# Altium schematic sheet Steering.SchDoc
size OrCAD B
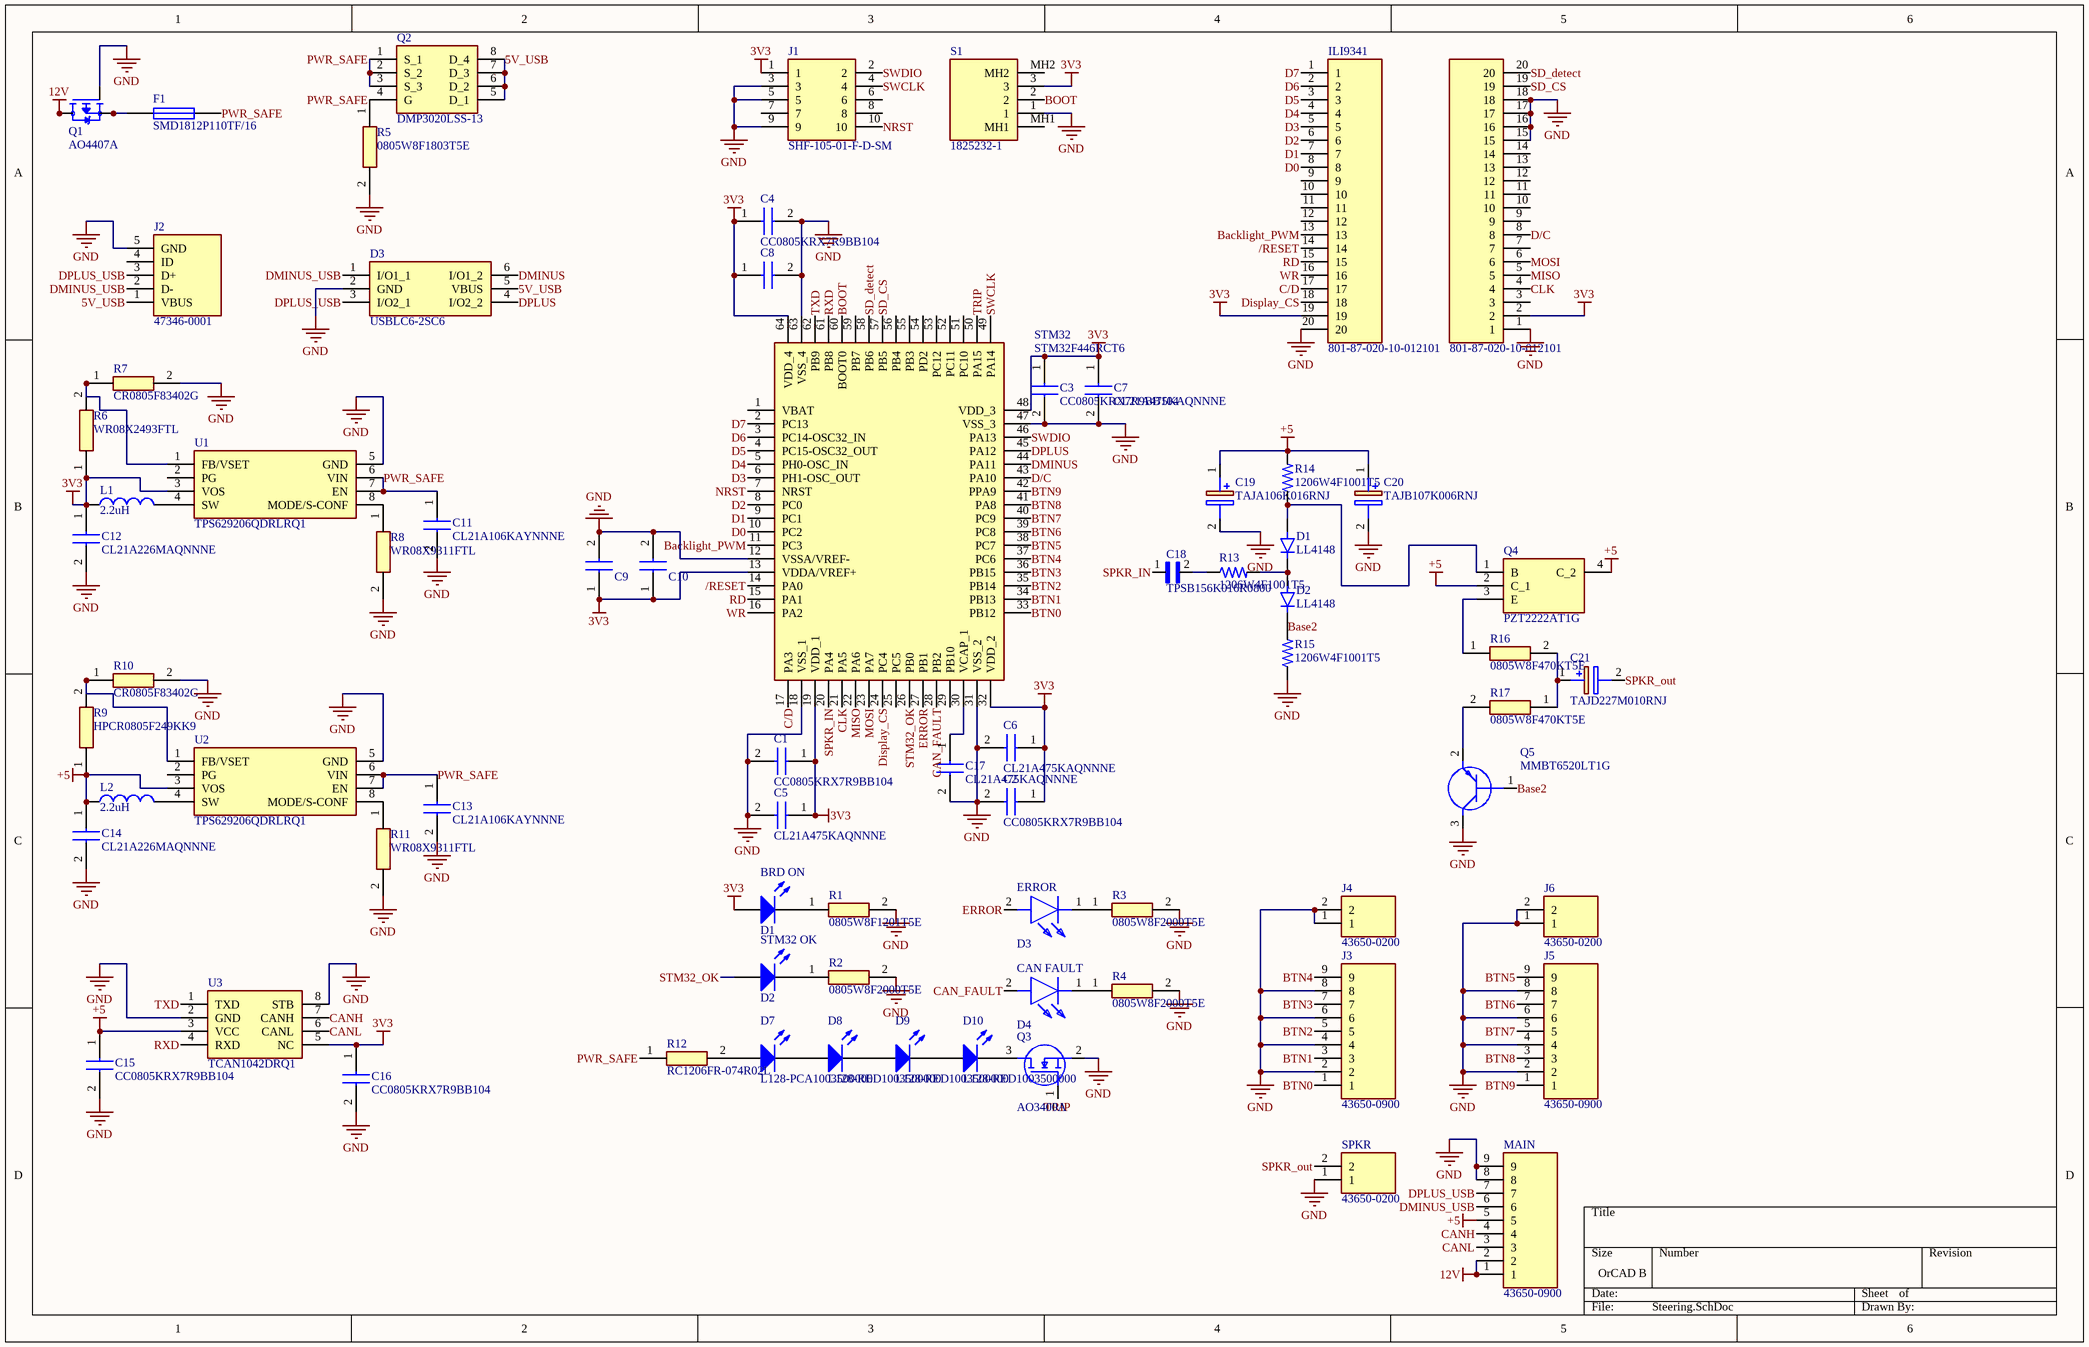
[diagram p0: Steering.SchDoc]

## Parts
?  801-87-020-10-012101  [RHDR20W62P0X254_1X20_5080X254X420P]
BRD_ON  D1  [C0805]
C1  CC0805KRX7R9BB104  [CAPC2012X95N]
C2  CC0805KRX7R9BB104  [CAPC2012X95N]
C3  CC0805KRX7R9BB104  [CAPC2012X95N]
C4  CC0805KRX7R9BB104  [CAPC2012X95N]
C5  CL21A475KAQNNNE  [CAPC2012X140N]
C6  CL21A475KAQNNNE  [CAPC2012X140N]
C7  CL21A475KAQNNNE  [CAPC2012X140N]
C8  CL21A475KAQNNNE  [CAPC2012X140N]  (value not drawn)
C9  CC0805KRX7R9BB104  [CAPC2012X95N]  (value not drawn)
C10  CL21A475KAQNNNE  [CAPC2012X140N]  (value not drawn)
C11  CL21A106KAYNNNE  [CAPC2012X145N]
C12  CL21A226MAQNNNE  [CAPC2012X140N]
C13  CL21A106KAYNNNE  [CAPC2012X145N]
C14  CL21A226MAQNNNE  [CAPC2012X140N]
C15  CC0805KRX7R9BB104  [CAPC2012X95N]
C16  CC0805KRX7R9BB104  [CAPC2012X95N]
C17  CL21A475KAQNNNE  [CAPC2012X140N]
C18  TPSB156K016R0800  [CAPPC3528X210N]
C19  TAJA106K016RNJ  [CAPPM3216X180N]
C20  TAJB107K006RNJ  [CAPPM3528X210N]
C21  TAJD227M010RNJ  [CAPPM7344X310N]
CAN_FAULT  D4  [LEDC1608X80N]
D1  LL4148  [DIO_LL4148]
D2  LL4148  [DIO_LL4148]
D3  USBLC6-2SC6  [SOT95P280X145-6N]
D7  L128-PCA1003500000  [LUXEON 2835]
D8  L128-RED1003500000  [LUXEON 2835]
D9  L128-RED1003500000  [LUXEON 2835]
D10  L128-RED1003500000  [LUXEON 2835]
ERROR  D3  [LEDC1608X80N]
F1  SMD1812P110TF/16  [FUSE_1812L200/12DR]
ILI9341  801-87-020-10-012101  [RHDR20W62P0X254_1X20_5080X254X420P]
J1  SHF-105-01-F-D-SM  [2002112100010C1LF]
J2  47346-0001  [47346-0001]
J3  43650-0900  [436500900]
J4  43650-0200  [43650-02(00,01,02)]
J5  43650-0900  [436500900]
J6  43650-0200  [43650-02(00,01,02)]
L1  value 2.2uH  [LVS505040-2R2M-N]  (hidden comment: LVS505040-2R2M-N)
L2  value 2.2uH  [LVS505040-2R2M-N]  (hidden comment: LVS505040-2R2M-N)
MAIN  43650-0900  [436500900]
Q1  AO4407A  [SOIC127P600X175-8N]
Q2  DMP3020LSS-13  [DMP3020LSS13]
Q3  AO3400A  [SOT95P280X125-3N]
Q4  PZT2222AT1G  [SOT230P700X175-4N]
Q5  MMBT6520LT1G  [SOT96P237X111-3N]
R1  0805W8F1201T5E  [RESC2012X60N]
R2  0805W8F2000T5E  [RESC2012X60N]
R3  0805W8F2000T5E  [RESC2012X60N]
R4  0805W8F2000T5E  [RESC2012X60N]
R5  0805W8F1803T5E  [RESC2012X60N]
R6  WR08X2493FTL  [RESC2012X60N]
R7  CR0805F83402G  [RESC2012X60N]
R8  WR08X9311FTL  [RESC2012X60N]
R9  HPCR0805F249KK9  [RESC2012X60N]
R10  CR0805F83402G  [RESC2012X60N]
R11  WR08X9311FTL  [RESC2012X60N]
R12  RC1206FR-074R02L  [RESC3116X65N]
R13  1206W4F1001T5  [RESC3115X65N]
R14  1206W4F1001T5  [RESC3115X65N]
R15  1206W4F1001T5  [RESC3115X65N]
R16  0805W8F470KT5E  [RESC2012X60N]
R17  0805W8F470KT5E  [RESC2012X60N]
S1  1825232-1  [18252321]
SPKR  43650-0200  [43650-02(00,01,02)]
STM32  STM32F446RCT6  [QFP50P1200X1200X160-64N]
STM32_OK  D2  [C0805]
U1  TPS629206QDRLRQ1  [SOTFL50P160X60-8N]
U2  TPS629206QDRLRQ1  [SOTFL50P160X60-8N]
U3  TCAN1042DRQ1  [SOIC127P600X175-8N]

## Nets
3V3: ?.2 BRD_ON.1(A) C1.1 C2.1 C3.1 C4.1 C5.1 C6.1 C7.1 C8.1 C9.1 C10.1 C12.1 C16.1 ILI9341.19 J1.1 L1.1 R6.1 S1.3 STM32.13(VDDA/VREF+) STM32.19(VDD_1) STM32.32(VDD_2) STM32.48(VDD_3) STM32.64(VDD_4) U1.3(VOS) U3.5(NC)
12V: MAIN.1 MAIN.2 Q1.5(D) Q1.6(D) Q1.7(D) Q1.8(D)
+5: C14.1 C15.1 C19.1(+) C20.1(+) L2.1 MAIN.5 Q4.2(C_1) Q4.4(C_2) R9.1 R14.2 U2.3(VOS) U3.3(VCC)
GND: ?.1 ?.15 ?.16 ?.17 ?.18 C1.2 C2.2 C3.2 C4.2 C5.2 C6.2 C7.2 C8.2 C9.2 C10.2 C11.2 C12.2 C13.2 C14.2 C15.2 C16.2 C17.2 C19.2(-) C20.2(-) D3.2(GND) ILI9341.20 J1.3 J1.5 J1.9 J2.5(GND) J3.2 J3.4 J3.6 J3.8 J4.1 J4.2 J5.2 J5.4 J5.6 J5.8 J6.1 J6.2 MAIN.8 MAIN.9 Q1.4(G) Q3.2(S) Q5.3(C) R1.2 R2.2 R3.2 R4.2 R5.2 R7.2 R8.2 R10.2 R11.2 R15.1 S1.1 SPKR.1 STM32.12(VSSA/VREF-) STM32.18(VSS_1) STM32.31(VSS_2) STM32.47(VSS_3) STM32.63(VSS_4) U1.5(GND) U2.5(GND) U3.2(GND) U3.8(STB)
5V_USB: D3.5(VBUS) J2.1(VBUS) Q2.5(D_1) Q2.6(D_2) Q2.7(D_3) Q2.8(D_4)
/RESET: ILI9341.14 STM32.14(PA0)
Backlight_PWM: ILI9341.13 STM32.11(PC3)
Base2: D2.C Q5.1(B) R15.2
BOOT: S1.2 STM32.60(BOOT0)
BTN0: J3.1 STM32.33(PB12)
BTN1: J3.3 STM32.34(PB13)
BTN2: J3.5 STM32.35(PB14)
BTN3: J3.7 STM32.36(PB15)
BTN4: J3.9 STM32.37(PC6)
BTN5: J5.9 STM32.38(PC7)
BTN6: J5.7 STM32.39(PC8)
BTN7: J5.5 STM32.40(PC9)
BTN8: J5.3 STM32.41(PA8)
BTN9: J5.1 STM32.42(PPA9)
C/D: ILI9341.17 STM32.17(PA3)
CAN_FAULT: CAN_FAULT.2(A) STM32.28(PB2)
CANH: MAIN.4 U3.7(CANH)
CANL: MAIN.3 U3.6(CANL)
CLK: ?.4 STM32.21(PA5)
D0: ILI9341.8 STM32.10(PC2)
D1: ILI9341.7 STM32.9(PC1)
D2: ILI9341.6 STM32.8(PC0)
D3: ILI9341.5 STM32.6(PH1-OSC_OUT)
D4: ILI9341.4 STM32.5(PH0-OSC_IN)
D5: ILI9341.3 STM32.4(PC15-OSC32_OUT)
D6: ILI9341.2 STM32.3(PC14-OSC32_IN)
D7: ILI9341.1 STM32.2(PC13)
D/C: ?.8 STM32.43(PA10)
Display_CS: ILI9341.18 STM32.24(PC4)
DMINUS: D3.6(I/O1_2) STM32.44(PA11)
DMINUS_USB: D3.1(I/O1_1) J2.2(D-) MAIN.6
DPLUS: D3.4(I/O2_2) STM32.45(PA12)
DPLUS_USB: D3.3(I/O2_1) J2.3(D+) MAIN.7
ERROR: ERROR.2(A) STM32.27(PB1)
MISO: ?.5 STM32.22(PA6)
MOSI: ?.6 STM32.23(PA7)
NRST: J1.10 STM32.7(NRST)
PWR_SAFE: C11.1 C13.1 F1.2 Q2.1(S_1) Q2.2(S_2) Q2.3(S_3) Q2.4(G) R5.1 R12.1 U1.6(VIN) U1.7(EN) U2.6(VIN) U2.7(EN)
RD: ILI9341.15 STM32.15(PA1)
RXD: STM32.61(PB8) U3.4(RXD)
SD_CS: ?.19 STM32.57(PB5)
SD_detect: ?.20 STM32.58(PB6)
SPKR_IN: C18.1 STM32.20(PA4)
SPKR_out: C21.2(-) SPKR.2
STM32_OK: STM32.26(PB0) STM32_OK.1(A)
SWCLK: J1.4 STM32.49(PA14)
SWDIO: J1.2 STM32.46(PA13)
TRIP: Q3.1(G) STM32.50(PA15)
TXD: STM32.62(PB9) U3.1(TXD)
WR: ILI9341.16 STM32.16(PA2)
NetBRD_ON_2: BRD_ON.2(K) R1.1
NetC17_1: C17.1 STM32.30(VCAP_1)
NetC18_2: C18.2 R13.1
NetC21_1: C21.1(+) R16.2 R17.1
NetCAN_FAULT_1: CAN_FAULT.1(K) R4.1
NetD1_A: D1.A Q4.1(B) R14.1
NetD1_C: D1.C D2.A R13.2
NetD7_1: D7.1(A) R12.2
NetD7_2: D7.2(K) D8.1(A)
NetD8_2: D8.2(K) D9.1(A)
NetD9_2: D9.2(K) D10.1(A)
NetD10_2: D10.2(K) Q3.3(D)
NetERROR_1: ERROR.1(K) R3.1
NetF1_1: F1.1 Q1.1(S) Q1.2(S) Q1.3(S)
NetL1_2: L1.2 U1.4(SW)
NetL2_2: L2.2 U2.4(SW)
NetQ4_3: Q4.3(E) R16.1
NetQ5_2: Q5.2(E) R17.2
NetR2_1: R2.1 STM32_OK.2(K)
NetR6_2: R6.2 R7.1 U1.1(FB/VSET)
NetR8_1: R8.1 U1.8(MODE/S-CONF)
NetR9_2: R9.2 R10.1 U2.1(FB/VSET)
NetR11_1: R11.1 U2.8(MODE/S-CONF)

Not connected (* = marked no-connect by the designer): ? 3 7 9 10 11 12 13 14; ILI9341 9 10 11 12; J1 6 7 8; J2 4(ID); S1 MH1 MH2; STM32 1(VBAT) 25(PC5) 29(PB10) 51(PC10) 52(PC11) 53(PC12) 54(PD2) 55(PB3) 56(PB4) 59(PB7); U1 2(PG); U2 2(PG)

## Library data of the parts
? ILI9341 = 801-87-020-10-012101: Connector; Manufacturer_Name: Preci-Dip; Datasheet Link: https://www.precidip.com/en/Products/PCB-Connectors/pview/801-PP-NNN-10-012101.html; Height: 4.2mm; Manufacturer_Part_Number: 801-87-020-10-012101; Mouser Part Number: 437-8018702010012101; Mouser Price/Stock: https://www.mouser.com/Search/ProductDetail.aspx?qs=q5BRkYolQ3gOW%2fp3dsbSdw%3d%3d
BRD_ON STM32_OK = LED0: C2297; Published: 8-Jun-2000; LatestRevisionDate: 08-Jul-2005; LatestRevisionNote: Mech Layer 1 removed.; PackageReference: LED-0; Publisher: Altium Limited; PackageDescription: LED; 2 Leads
C1-C4 C9 C15 C16 = CC0805KRX7R9BB104: C49678; Manufacturer_Name: YAGEO; Datasheet Link: https://www.yageo.com/upload/media/product/productsearch/datasheet/mlcc/UPY-GPHC_X7R_6.3V-to-50V_20.pdf; Height: 0.95mm; Manufacturer_Part_Number: CC0805KRX7R9BB104; Mouser Part Number: 603-CC805KRX7R9BB104; Mouser Price/Stock: https://www.mouser.co.uk/ProductDetail/YAGEO/CC0805KRX7R9BB104?qs=vTakOoo5QyLx0lXWgVtRhQ%3D%3D; Arrow Part Number: CC0805KRX7R9BB104; Arrow Price/Stock: https://www.arrow.com/en/products/cc0805krx7r9bb104/yageo?region=europe
C5-C8 C10 C17 = CL21A475KAQNNNE: C1779; Manufacturer_Name: Samsung Electro-Mechanics; Datasheet Link: https://datasheet.datasheetarchive.com/originals/distributors/Datasheets_SAMA/7c2e9fae61a8ce6685f6522ddec12c79.pdf; Height: 1.4mm; Manufacturer_Part_Number: CL21A475KAQNNNE
C11 C13 = CL21A106KAYNNNE: C15850; Manufacturer_Name: Samsung Electro-Mechanics; Datasheet Link: https://datasheet.datasheetarchive.com/originals/distributors/Datasheets_SAMA/6a45835c9b7400e9b49c55c38a8ff4a2.pdf; Height: 1.45mm; Manufacturer_Part_Number: CL21A106KAYNNNE
C12 C14 = CL21A226MAQNNNE: C45783; Manufacturer_Name: Samsung Electro-Mechanics; Datasheet Link: https://datasheet.datasheetarchive.com/originals/distributors/Datasheets-DGA10/2406310.pdf; Height: 1.4mm; Manufacturer_Part_Number: CL21A226MAQNNNE
C18 = TPSB156K016R0800: C308885; Package: None; Price: None; Value: *; MP: TPSB156K016R0800; Availability: Unavailable
C19 = TAJA106K016RNJ: C7171; Manufacturer_Name: AVX; Datasheet Link: http://www.farnell.com/datasheets/1680476.pdf; Height: 1.8mm; Manufacturer_Part_Number: TAJA106K016RNJ; Mouser Part Number: 581-TAJA106K016R; Mouser Price/Stock: https://www.mouser.co.uk/ProductDetail/AVX/TAJA106K016RNJ?qs=OVpPYgiJXXV05Cvf2fCYWQ%3D%3D; Arrow Part Number: TAJA106K016RNJ; Arrow Price/Stock: https://www.arrow.com/en/products/taja106k016rnj/avx
C20 = TAJB107K006RNJ: C16133; Manufacturer_Name: AVX; Datasheet Link: http://datasheets.avx.com/TAJ.pdf; Height: 2.1mm; Manufacturer_Part_Number: TAJB107K006RNJ; Mouser Part Number: 581-TAJB107K006R; Mouser Price/Stock: https://www.mouser.co.uk/ProductDetail/AVX/TAJB107K006RNJ?qs=fdqkYiOtZpcsxthKdBMg8Q%3D%3D; Arrow Part Number: TAJB107K006RNJ; Arrow Price/Stock: https://www.arrow.com/en/products/tajb107k006rnj/avx?region=nac
C21 = TAJD227M010RNJ: C11381; Manufacturer_Name: AVX; Datasheet Link: http://datasheets.avx.com/TAJ.pdf; Height: 3.1mm; Manufacturer_Part_Number: TAJD227M010RNJ; Mouser Part Number: 581-TAJD227M010R; Mouser Price/Stock: https://www.mouser.co.uk/ProductDetail/AVX/TAJD227M010RNJ?qs=vQJa%252BfcOt8NxOIbJEsT5Zg%3D%3D; Arrow Part Number: TAJD227M010RNJ; Arrow Price/Stock: https://www.arrow.com/en/products/tajd227m010rnj/avx
CAN_FAULT ERROR = 150060VS75000: C2286; Manufacturer_Name: Wurth Elektronik; Datasheet Link: https://componentsearchengine.com/Datasheets/2/150060VS75000.pdf; Height: 0.8mm; Manufacturer_Part_Number: 150060VS75000; Mouser Part Number: 710-150060VS75000; Mouser Price/Stock: https://www.mouser.co.uk/ProductDetail/Wurth-Elektronik/150060VS75000?qs=LlUlMxKIyB1Q1Bi5mQ%2FKLw%3D%3D
D1 D2 = LL4148: C9808; MF: Diotec Semiconductor; Value: *; SnapEDA_Link: https://www.snapeda.com/parts/LL4148/Diotec/view-part/?ref=snap; Purchase-URL: https://pricing.snapeda.com/search/part/LL4148/?ref=eda; Availability: In Stock; Price: None; Package: MINIMELF-2 Diotec; Check_prices: https://www.snapeda.com/parts/LL4148/Diotec/view-part/?ref=eda; MP: LL4148
D3 = USBLC6-2SC6: C5180249; Manufacturer_Name: STMicroelectronics; Datasheet Link: https://componentsearchengine.com//USBLC6-2SC6.pdf; Height: 1.45mm; Mouser2 Part Number: 511-USBLC6-2SC6; Mouser2 Price/Stock: https://www.mouser.com/Search/Refine.aspx?Keyword=511-USBLC6-2SC6; Manufacturer_Part_Number: USBLC6-2SC6
D7-D10 = LED0: Published: 8-Jun-2000; LatestRevisionDate: 08-Jul-2005; LatestRevisionNote: Mech Layer 1 removed.; PackageReference: LED-0; Publisher: Altium Limited; PackageDescription: LED; 2 Leads
F1 = Fuse 1: C209723; Published: 8-Jun-2000; LatestRevisionDate: 17-Jul-2002; LatestRevisionNote: Re-released for DXP Platform.; PackageReference: PIN-W2/E2.8; Publisher: Altium Limited; PackageDescription: Thru-Hole; 2 Leads
J1 = 20021121-00010C1LF: Connector; Manufacturer_Name: Amphenol Communication Solutions; Datasheet Link: https://cdn.amphenol-cs.com/media/wysiwyg/files/drawing/20021121.pdf; Height: 5.5mm; Manufacturer_Part_Number: 20021121-00010C1LF; Mouser Part Number: 649-200211210010C1LF; Mouser Price/Stock: https://www.mouser.co.uk/ProductDetail/Amphenol-FCI/20021121-00010C1LF?qs=oJs1R%252BxK6kSzutWTkBqfDw%3D%3D; Arrow Part Number: 20021121-00010C1LF; Arrow Price/Stock: https://www.arrow.com/en/products/20021121-00010c1lf/amphenol-fci
J2 = 47346-0001: C132560; Manufacturer_Name: Molex; Datasheet Link: http://www.molex.com/pdm_docs/sd/473460001_sd.pdf; Manufacturer_Part_Number: 47346-0001
J3 J5 MAIN = 43650-0900: Connector; Manufacturer_Name: Molex; Datasheet Link: https://www.molex.com/pdm_docs/sd/436500900_sd.pdf; Height: 5.57mm; Manufacturer_Part_Number: 43650-0900
J4 J6 SPKR = 43650-0200: Connector; Manufacturer_Name: Molex; Datasheet Link: https://www.molex.com/pdm_docs/sd/436500200_sd.pdf; Height: 5.57mm; Manufacturer_Part_Number: 43650-0200; Mouser Part Number: 538-43650-0200; Mouser Price/Stock: https://www.mouser.co.uk/ProductDetail/Molex/43650-0200?qs=HlEFOAM0q6XGaAJJj3Pssw%3D%3D
L1 L2 = Inductor: C280539; Code_IEC: 1005; Published: 8-Jun-2000; LatestRevisionDate: 29-May-2009; LatestRevisionNote: IPC-7351 Footprint Added.; PackageReference: 0402-A; Publisher: Altium Limited; PackageDescription: Chip Inductor; Code_JEITA: 0402
Q1 = AO4407A: C382328; MF: Alpha &; Value: *; SnapEDA_Link: https://www.snapeda.com/parts/AO4407A/Alpha%20%26%20Omega%20Semiconductor%20Inc./view-part/492696/?ref=snap; MP: AO4407A; Availability: Unavailable; Price: None; Package: SOIC-8 Alpha &amp; Omega Semiconductor
Q2 = DMP3020LSS-13: C382328; Manufacturer_Name: Diodes Inc.; Datasheet Link: http://uk.rs-online.com/web/p/products/8234028; Height: 1.75mm; Manufacturer_Part_Number: DMP3020LSS-13; Mouser Part Number: 621-DMP3020LSS-13; Mouser Price/Stock: https://www.mouser.co.uk/ProductDetail/Diodes-Incorporated/DMP3020LSS-13?qs=ptj1V1atRApSH7nA47yoew%3D%3D
Q3 = AO3400A: C20917; Manufacturer_Name: Alpha & Omega Semiconductors; Datasheet Link: http://aosmd.com/res/data_sheets/AO3400A.pdf; Height: 1.25mm; Manufacturer_Part_Number: AO3400A; Arrow Part Number: AO3400A; Arrow Price/Stock: https://www.arrow.com/en/products/ao3400a/alpha-and-omega-semiconductor?region=europe
Q4 = PZT2222AT1G: C115272; Manufacturer_Name: onsemi; Datasheet Link: http://www.onsemi.com/pub/Collateral/PZT2222AT1-D.PDF; Height: 1.75mm; Manufacturer_Part_Number: PZT2222AT1G; Mouser Part Number: 863-PZT2222AT1G; Mouser Price/Stock: https://www.mouser.co.uk/ProductDetail/onsemi/PZT2222AT1G?qs=xZq1yRCsb1df8552Y4NpWQ%3D%3D; Arrow Part Number: PZT2222AT1G; Arrow Price/Stock: https://www.arrow.com/en/products/pzt2222at1g/on-semiconductor?region=europe
Q5 = MMBT6520LT1G: C94999; Manufacturer_Name: onsemi; Datasheet Link: http://www.onsemi.com/pub/Collateral/MMBT6520LT1-D.PDF; Height: 1.11mm; Manufacturer_Part_Number: MMBT6520LT1G; Mouser Part Number: 863-MMBT6520LT1G; Mouser Price/Stock: https://www.mouser.co.uk/ProductDetail/onsemi/MMBT6520LT1G?qs=HVbQlW5zcXW6B5Cj3%252BF%252BaQ%3D%3D; Arrow Part Number: MMBT6520LT1G; Arrow Price/Stock: https://www.arrow.com/en/products/mmbt6520lt1g/on-semiconductor?region=nac
R1 = RK73H2ATTD1543F: C17379; Manufacturer_Name: KOA Speer; Datasheet Link: http://www.koaspeer.com/catimages/Products/RK73H/RK73H.pdf; Height: 0.6mm; Manufacturer_Part_Number: RK73H2ATTD1543F; Mouser Part Number: 660-RK73H2ATTD1543F; Mouser Price/Stock: https://www.mouser.co.uk/ProductDetail/KOA-Speer/RK73H2ATTD1543F?qs=thJ8CQs%2FE%2FulTjcEA4nvBA%3D%3D
R2-R4 = RK73H2ATTD1543F: C17540; Manufacturer_Name: KOA Speer; Datasheet Link: http://www.koaspeer.com/catimages/Products/RK73H/RK73H.pdf; Height: 0.6mm; Manufacturer_Part_Number: RK73H2ATTD1543F; Mouser Part Number: 660-RK73H2ATTD1543F; Mouser Price/Stock: https://www.mouser.co.uk/ProductDetail/KOA-Speer/RK73H2ATTD1543F?qs=thJ8CQs%2FE%2FulTjcEA4nvBA%3D%3D
R5 = RK73H2ATTD1543F: C17501; Manufacturer_Name: KOA Speer; Datasheet Link: http://www.koaspeer.com/catimages/Products/RK73H/RK73H.pdf; Height: 0.6mm; Manufacturer_Part_Number: RK73H2ATTD1543F; Mouser Part Number: 660-RK73H2ATTD1543F; Mouser Price/Stock: https://www.mouser.co.uk/ProductDetail/KOA-Speer/RK73H2ATTD1543F?qs=thJ8CQs%2FE%2FulTjcEA4nvBA%3D%3D
R6 = RK73H2ATTD1543F: C170853; Manufacturer_Name: KOA Speer; Datasheet Link: http://www.koaspeer.com/catimages/Products/RK73H/RK73H.pdf; Height: 0.6mm; Manufacturer_Part_Number: RK73H2ATTD1543F; Mouser Part Number: 660-RK73H2ATTD1543F; Mouser Price/Stock: https://www.mouser.co.uk/ProductDetail/KOA-Speer/RK73H2ATTD1543F?qs=thJ8CQs%2FE%2FulTjcEA4nvBA%3D%3D
R7 R10 = RK73H2ATTD1543F: C101673; Manufacturer_Name: KOA Speer; Datasheet Link: http://www.koaspeer.com/catimages/Products/RK73H/RK73H.pdf; Height: 0.6mm; Manufacturer_Part_Number: RK73H2ATTD1543F; Mouser Part Number: 660-RK73H2ATTD1543F; Mouser Price/Stock: https://www.mouser.co.uk/ProductDetail/KOA-Speer/RK73H2ATTD1543F?qs=thJ8CQs%2FE%2FulTjcEA4nvBA%3D%3D
R8 R11 = RK73H2ATTD1543F: C334950; Manufacturer_Name: KOA Speer; Datasheet Link: http://www.koaspeer.com/catimages/Products/RK73H/RK73H.pdf; Height: 0.6mm; Manufacturer_Part_Number: RK73H2ATTD1543F; Mouser Part Number: 660-RK73H2ATTD1543F; Mouser Price/Stock: https://www.mouser.co.uk/ProductDetail/KOA-Speer/RK73H2ATTD1543F?qs=thJ8CQs%2FE%2FulTjcEA4nvBA%3D%3D
R9 = RK73H2ATTD1543F: C365271; Manufacturer_Name: KOA Speer; Datasheet Link: http://www.koaspeer.com/catimages/Products/RK73H/RK73H.pdf; Height: 0.6mm; Manufacturer_Part_Number: RK73H2ATTD1543F; Mouser Part Number: 660-RK73H2ATTD1543F; Mouser Price/Stock: https://www.mouser.co.uk/ProductDetail/KOA-Speer/RK73H2ATTD1543F?qs=thJ8CQs%2FE%2FulTjcEA4nvBA%3D%3D
R12 = CRGH1206J47R: Resistor; Manufacturer_Name: TE Connectivity; Datasheet Link: https://datasheet.datasheetarchive.com/originals/distributors/DKDS-21/401697.pdf; Height: 0.65mm; Manufacturer_Part_Number: CRGH1206J47R; Mouser Part Number: 279-CRGH1206J47R; Mouser Price/Stock: https://www.mouser.co.uk/ProductDetail/TE-Connectivity-Holsworthy/CRGH1206J47R?qs=8G8kQhBkhGhjy%252BXe1hT%2FBA%3D%3D
R13-R15 = 6-1879261-8: C4410; Package: None; Price: None; Value: *; MP: 6-1879261-8; Availability: Unavailable
R16 R17 = RK73H2ATTD1543F: C17675; Manufacturer_Name: KOA Speer; Datasheet Link: http://www.koaspeer.com/catimages/Products/RK73H/RK73H.pdf; Height: 0.6mm; Manufacturer_Part_Number: RK73H2ATTD1543F; Mouser Part Number: 660-RK73H2ATTD1543F; Mouser Price/Stock: https://www.mouser.co.uk/ProductDetail/KOA-Speer/RK73H2ATTD1543F?qs=thJ8CQs%2FE%2FulTjcEA4nvBA%3D%3D
S1 = 1825232-1: Switch; Manufacturer_Name: TE Connectivity; Datasheet Link: https://componentsearchengine.com/Datasheets/1/1825232-1.pdf; Height: 3.7mm; Manufacturer_Part_Number: 1825232-1; Mouser Part Number: 655-1825232-1; Mouser Price/Stock: https://www.mouser.co.uk/ProductDetail/TE-Connectivity-PB/1825232-1?qs=kTKVN3NWb5FosGxaNC1%252BtA%3D%3D; Arrow Part Number: 1825232-1; Arrow Price/Stock: https://www.arrow.com/en/products/1825232-1/te-connectivity?region=europe
STM32 = STM32F446RCT6: C915971; Manufacturer_Name: STMicroelectronics; Datasheet Link: http://www.st.com/content/ccc/resource/technical/document/datasheet/65/cb/75/50/53/d6/48/24/DM00141306.pdf/files/DM00141306.pdf/jcr:content/translations/en.DM00141306.pdf; Height: 1.6mm; Manufacturer_Part_Number: STM32F446RCT6; Mouser Part Number: 511-STM32F446RCT6; Mouser Price/Stock: https://www.mouser.co.uk/ProductDetail/STMicroelectronics/STM32F446RCT6?qs=Ok1pvOkw6%2FrlZ63GppV%2FkA%3D%3D; Arrow Part Number: STM32F446RCT6; Arrow Price/Stock: https://www.arrow.com/en/products/stm32f446rct6/stmicroelectronics?region=nac
U1 U2 = TPS629206QDRLRQ1: Integrated Circuit; Manufacturer_Name: Texas Instruments; Datasheet Link: https://www.ti.com/lit/gpn/TPS629206-Q1; Height: 0.6mm; Manufacturer_Part_Number: TPS629206QDRLRQ1; Mouser Part Number: 595-TPS629206QDRLRQ1; Mouser Price/Stock: https://www.mouser.co.uk/ProductDetail/Texas-Instruments/TPS629206QDRLRQ1?qs=Znm5pLBrcAKSjTz%252BzqwnCQ%3D%3D
U3 = TCAN1042DRQ1: C485806; Manufacturer_Name: Texas Instruments; Datasheet Link: http://www.ti.com/lit/gpn/TCAN1042-Q1; Height: 1.75mm; Manufacturer_Part_Number: TCAN1042DRQ1; Mouser Part Number: 595-TCAN1042DRQ1; Mouser Price/Stock: https://www.mouser.co.uk/ProductDetail/Texas-Instruments/TCAN1042DRQ1?qs=yDQnu9hAfI91M2D1wCnEBQ%3D%3D; Arrow Part Number: TCAN1042DRQ1; Arrow Price/Stock: https://www.arrow.com/en/products/tcan1042drq1/texas-instruments